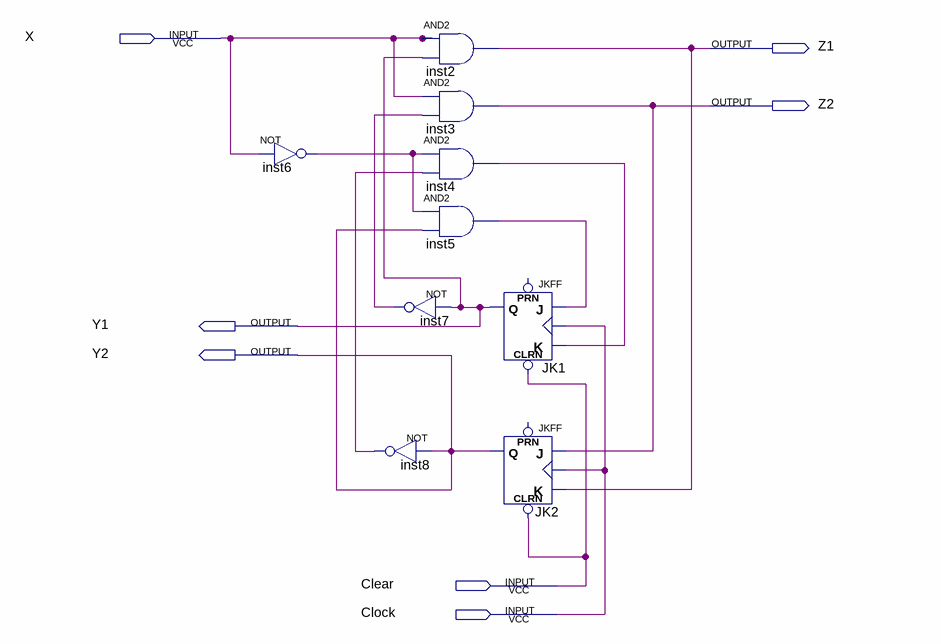
[diagram p0: schematic sheet]
// Quartus schematic slide10pointone.bdf as structural Verilog: 9 symbols, 7 pins
module slide10pointone (
  input  X,
  input  Clear,
  input  Clock,
  output Z1,
  output Z2,
  output Y1,
  output Y2
);

  wire inst4_out, inst5_out, inst6_out, inst7_out, inst8_out;

  not inst6 (inst6_out, X);
  not inst8 (inst8_out, Y2);
  and inst2 (Z1, X, Y1);
  and inst3 (Z2, X, inst7_out);
  and inst4 (inst4_out, inst6_out, inst8_out);
  and inst5 (inst5_out, inst6_out, Y2);
  not inst7 (inst7_out, Y1);
  JKFF JK1 (.CLRN(Clear), .K(inst4_out), .J(inst5_out), .CLK(Clock), .Q(Y1));  // open: PRN
  JKFF JK2 (.CLRN(Clear), .K(Z1), .J(Z2), .CLK(Clock), .Q(Y2));  // open: PRN
endmodule
